# EAGLE design stereo-pwm-v2 (EAGLE 5.04)
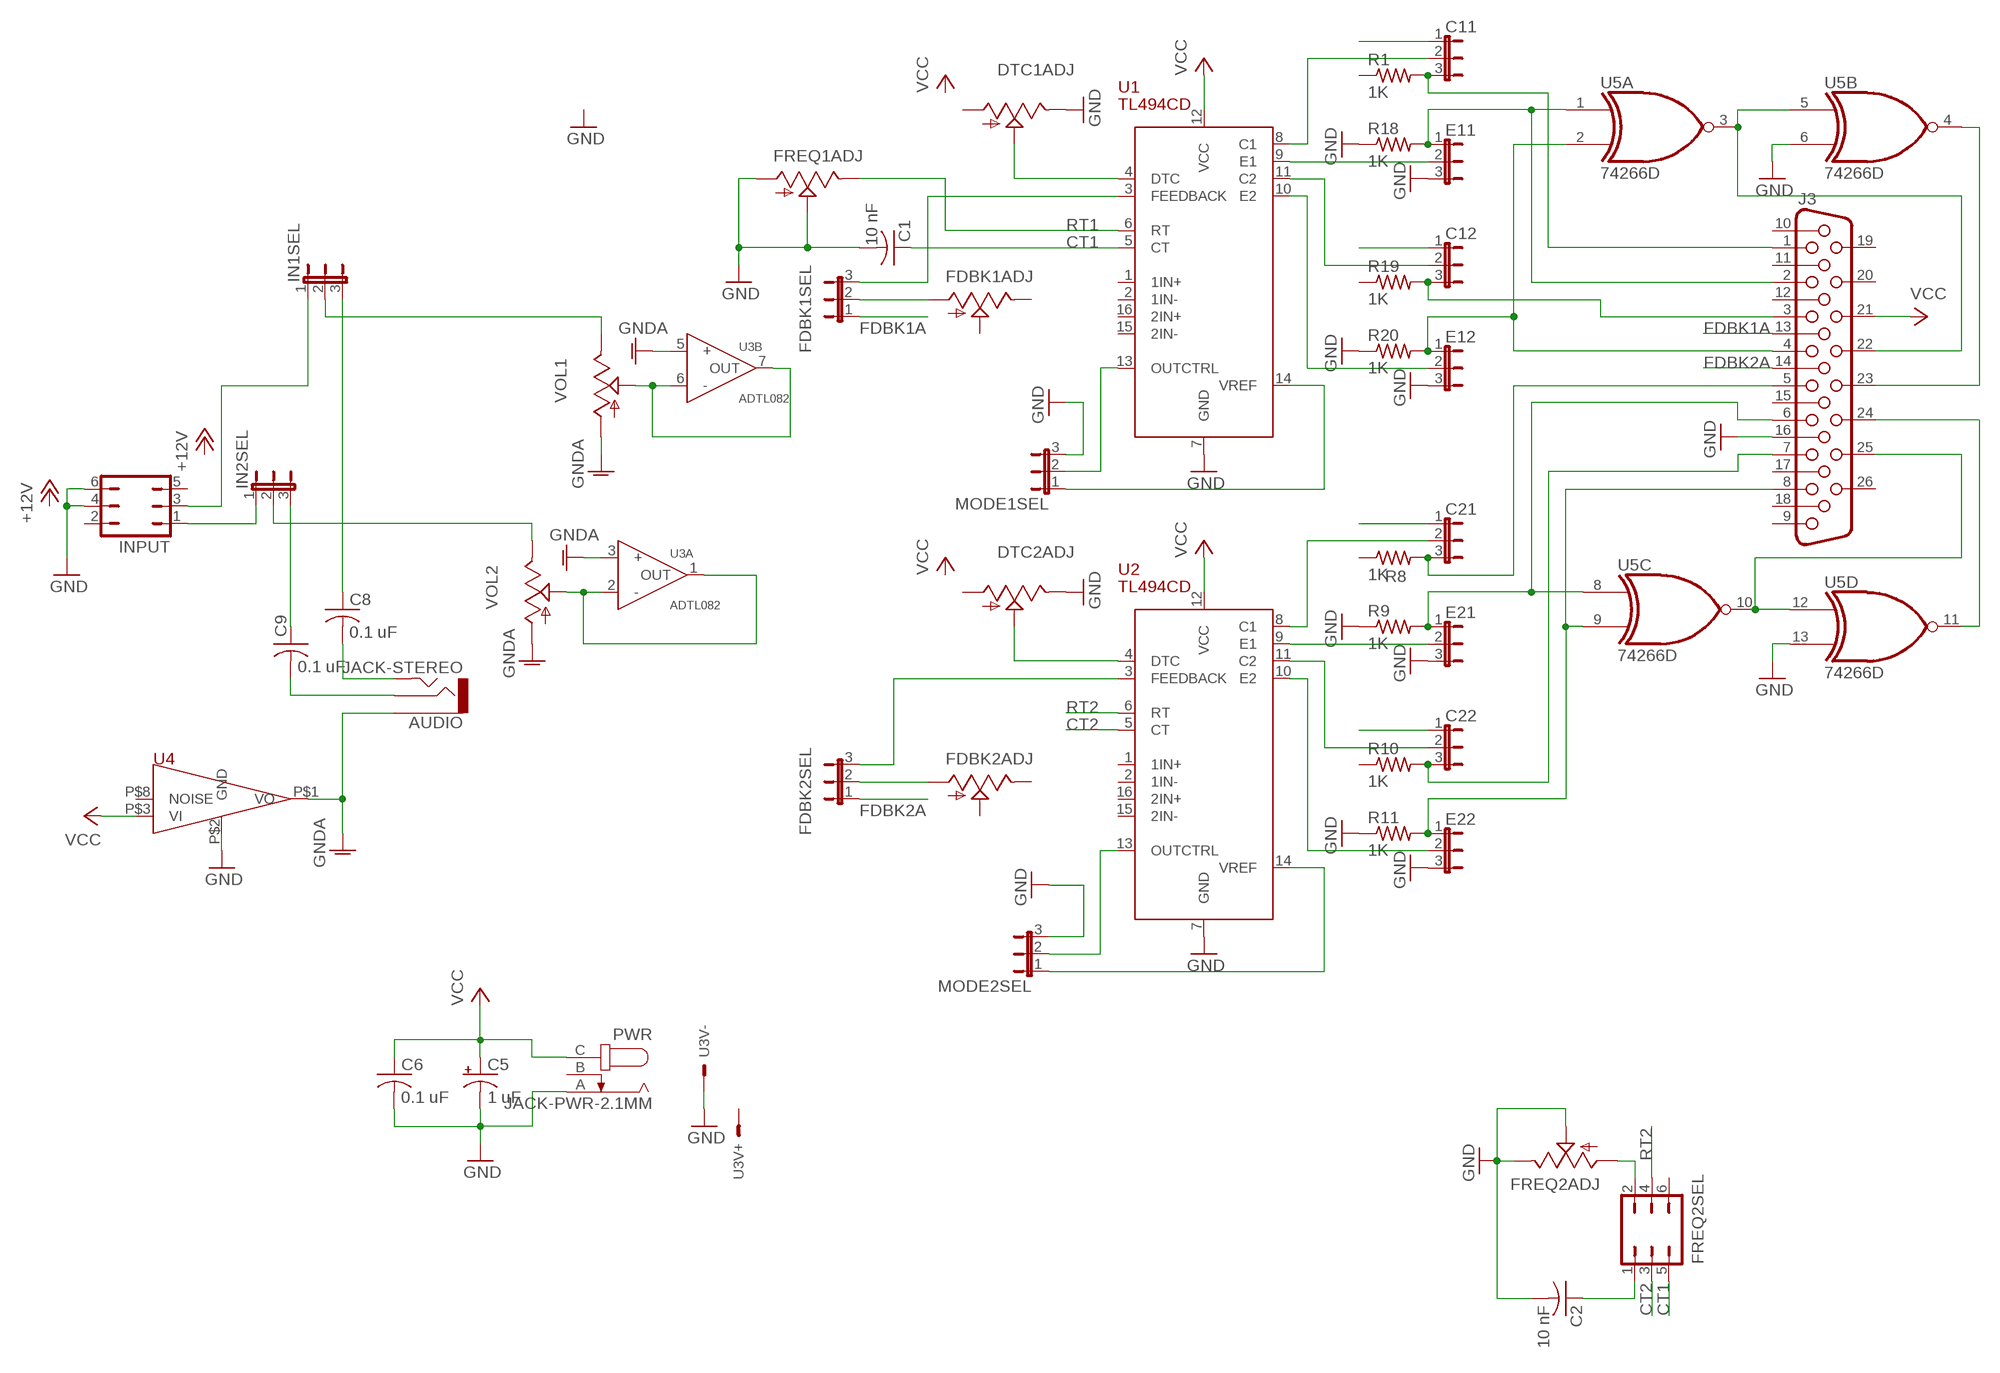
[diagram p0: schematic, sheet 1]

## Parts
AUDIO  JACK-STEREO  [AUDIO-JACK]
C1  10 nF  C-USC0603  [C0603]
C2  10 nF  C-USC0603  [C0603]
C5  1 uF  CPOL-US153CLV-0405  [153CLV-0405]
C6  0.1 uF  C-USC1206  [C1206]
C8  0.1 uF  C-USC1206  [C1206]
C9  0.1 uF  C-USC1206  [C1206]
C11  JP2E  [JP2]
C12  JP2E  [JP2]
C21  JP2E  [JP2]
C22  JP2E  [JP2]
DTC1ADJ  TRIM_US-CT6  [CT6]
DTC2ADJ  TRIM_US-CT6  [CT6]
E11  JP2E  [JP2]
E12  JP2E  [JP2]
E21  JP2E  [JP2]
E22  JP2E  [JP2]
FDBK1ADJ  TRIM_US-CT6  [CT6]
FDBK1SEL  JP2E  [JP2]
FDBK2ADJ  TRIM_US-CT6  [CT6]
FDBK2SEL  JP2E  [JP2]
FREQ1ADJ  TRIM_US-CT6  [CT6]
FREQ2ADJ  TRIM_US-CT6  [CT6]
FREQ2SEL  JP3Q  [JP3Q]
IN1SEL  JP2E  [JP2]
IN2SEL  JP2E  [JP2]
INPUT  JP3Q  [JP3Q]
J3  HF26V  [HDF26V]
MODE1SEL  JP2E  [JP2]
MODE2SEL  JP2E  [JP2]
PWR  JACK-PWR-2.1MM  [2.1MM-JACK-PLUG]
R1  1K  R-US_R0603  [R0603]
R8  1K  R-US_R0603  [R0603]
R9  1K  R-US_R0603  [R0603]
R10  1K  R-US_R0603  [R0603]
R11  1K  R-US_R0603  [R0603]
R18  1K  R-US_R0603  [R0603]
R19  1K  R-US_R0603  [R0603]
R20  1K  R-US_R0603  [R0603]
U1  TL494CD  [SO16]
U2  TL494CD  [SO16]
U3  ADTL082  [SO8]
U4  TLE2426  [SOIC-8]
U5  74266D  [SO14]
VOL1  TRIM_US-CT6  [CT6]
VOL2  TRIM_US-CT6  [CT6]

## Nets
C21: C21.3 J3.5 R8.2
CT1: C1.1 FREQ2SEL.5 U1.5(CT)
CT2: FREQ2SEL.3 U2.5(CT)
FDBK1A: FDBK1SEL.1 J3.13
FDBK2A: FDBK2SEL.1 J3.14
GND: C1.2 C2.2 C5.- C6.2 DTC1ADJ.E DTC2ADJ.E E11.3 E12.3 E21.3 E22.3 FREQ1ADJ.A FREQ1ADJ.S FREQ2ADJ.E FREQ2ADJ.S INPUT.4 INPUT.6 J3.16 MODE1SEL.3 MODE2SEL.3 PWR.A R9.1 R11.1 R18.1 R20.1 U1.7(GND) U2.7(GND) U3.4(V-:S) U4.P$2(GND) U5.6(B:I1) U5.13(D:I1)
GNDA: AUDIO.1 U3.3(A:+) U3.5(B:+) U4.P$1(VO) VOL1.A VOL2.A
N$1: MODE2SEL.2 U2.13(OUTCTRL)
N$2: FREQ2ADJ.A FREQ2SEL.2
N$3: MODE1SEL.2 U1.13(OUTCTRL)
N$4: IN2SEL.2 VOL2.E
N$5: C21.2 U2.8(C1)
N$6: E21.2 U2.9(E1)
N$7: E22.2 U2.10(E2)
N$8: AUDIO.3 C8.2
N$9: C22.2 U2.11(C2)
N$10: C2.1 FREQ2SEL.1
N$11: FDBK1SEL.3 U1.3(FEEDBACK)
N$12: AUDIO.2 C9.2
N$13: MODE1SEL.1 U1.14(VREF)
N$14: E21.1 J3.6 R9.2 U5.8(C:I0)
N$15: C22.3 J3.7 R10.2
N$16: E22.1 J3.8 R11.2 U5.9(C:I1)
N$17: DTC1ADJ.S U1.4(DTC)
N$18: IN1SEL.2 VOL1.E
N$19: C8.1 IN1SEL.3
N$20: FDBK1ADJ.A FDBK1SEL.2
N$21: DTC2ADJ.S
N$22: U3.6(B:-) U3.7(B:OUT) VOL1.S
N$23: C9.1 IN2SEL.3
N$24: C11.2 U1.8(C1)
N$25: IN2SEL.1 INPUT.1
N$26: IN1SEL.1 INPUT.3
N$27: E11.2
N$28: C22.1
N$29: C21.1
N$30: C12.1
N$31: U3.1(A:OUT) U3.2(A:-) VOL2.S
N$32: E12.2 U1.10(E2)
N$33: C12.2 U1.11(C2)
N$34: C11.1
N$36: C11.3 J3.1 R1.2
N$37: E11.1 J3.2 R18.2 U5.1(A:I0)
N$38: C12.3 J3.3 R19.2
N$39: E12.1 J3.4 R20.2 U5.2(A:I1)
N$40: J3.22 U5.3(A:O) U5.5(B:I0)
N$41: J3.24 U5.11(D:O)
N$42: J3.25 U5.10(C:O) U5.12(D:I0)
N$44: MODE2SEL.1 U2.14(VREF)
N$45: J3.23 U5.4(B:O)
N$46: FDBK2ADJ.A FDBK2SEL.2
N$47: FDBK2SEL.3 U2.3(FEEDBACK)
RT1: FREQ1ADJ.E U1.6(RT)
RT2: FREQ2SEL.4 U2.6(RT)
VCC: C5.+ C6.1 J3.21 PWR.C U1.12(VCC) U2.12(VCC) U4.P$3(VI)
Unconnected: DTC1ADJ.A DTC2ADJ.A FDBK1ADJ.E FDBK1ADJ.S FDBK2ADJ.E FDBK2ADJ.S FREQ2SEL.6 INPUT.2 INPUT.5 J3.9 J3.10 J3.11 J3.12 J3.15 J3.17 J3.18 J3.19 J3.20 J3.26 PWR.B R1.1 R8.1 R10.1 R19.1 U1.1(1IN+) U1.2(1IN-) U1.9(E1) U1.15(2IN-) U1.16(2IN+) U2.1(1IN+) U2.2(1IN-) U2.4(DTC) U2.15(2IN-) U2.16(2IN+) U3.8(V+:S) U4.P$8(NOISE)

## Power pins joined to a net without a drawn wire
GND: U5.7(P:GND)
VCC: U5.14(P:VCC)

## Library data of the parts
AUDIO = logos-faves:JACK-STEREO
C1 C2 C6 C8 C9 = resistor:C-US: CAPACITOR, American symbol
C5 = resistor:CPOL-US: POLARIZED CAPACITOR, American symbol
C11 C12 C21 C22 E11 E12 E21 E22 FDBK1SEL FDBK2SEL IN1SEL IN2SEL MODE1SEL MODE2SEL = jumper:JP2E: JUMPER
DTC1ADJ DTC2ADJ FDBK1ADJ FDBK2ADJ FREQ1ADJ FREQ2ADJ VOL1 VOL2 = pot:TRIM_US-: POTENTIOMETER
FREQ2SEL INPUT = jumper:JP3Q: JUMPER
J3 = con-subd:HF26: SUB-D
PWR = logos-faves:JACK-PWR-2.1MM
R1 R8-R11 R18-R20 = resistor:R-US_: RESISTOR, American symbol
U1 U2 = logos-faves:TL494CD
U3 = logos-faves:ADTL082: dual op-amp
U4 = logos-faves:TLE2426
U5 = 74xx-us:74*266: Quadruple EXCLUSIVE-NOR (XNOR), open-collector

## Board
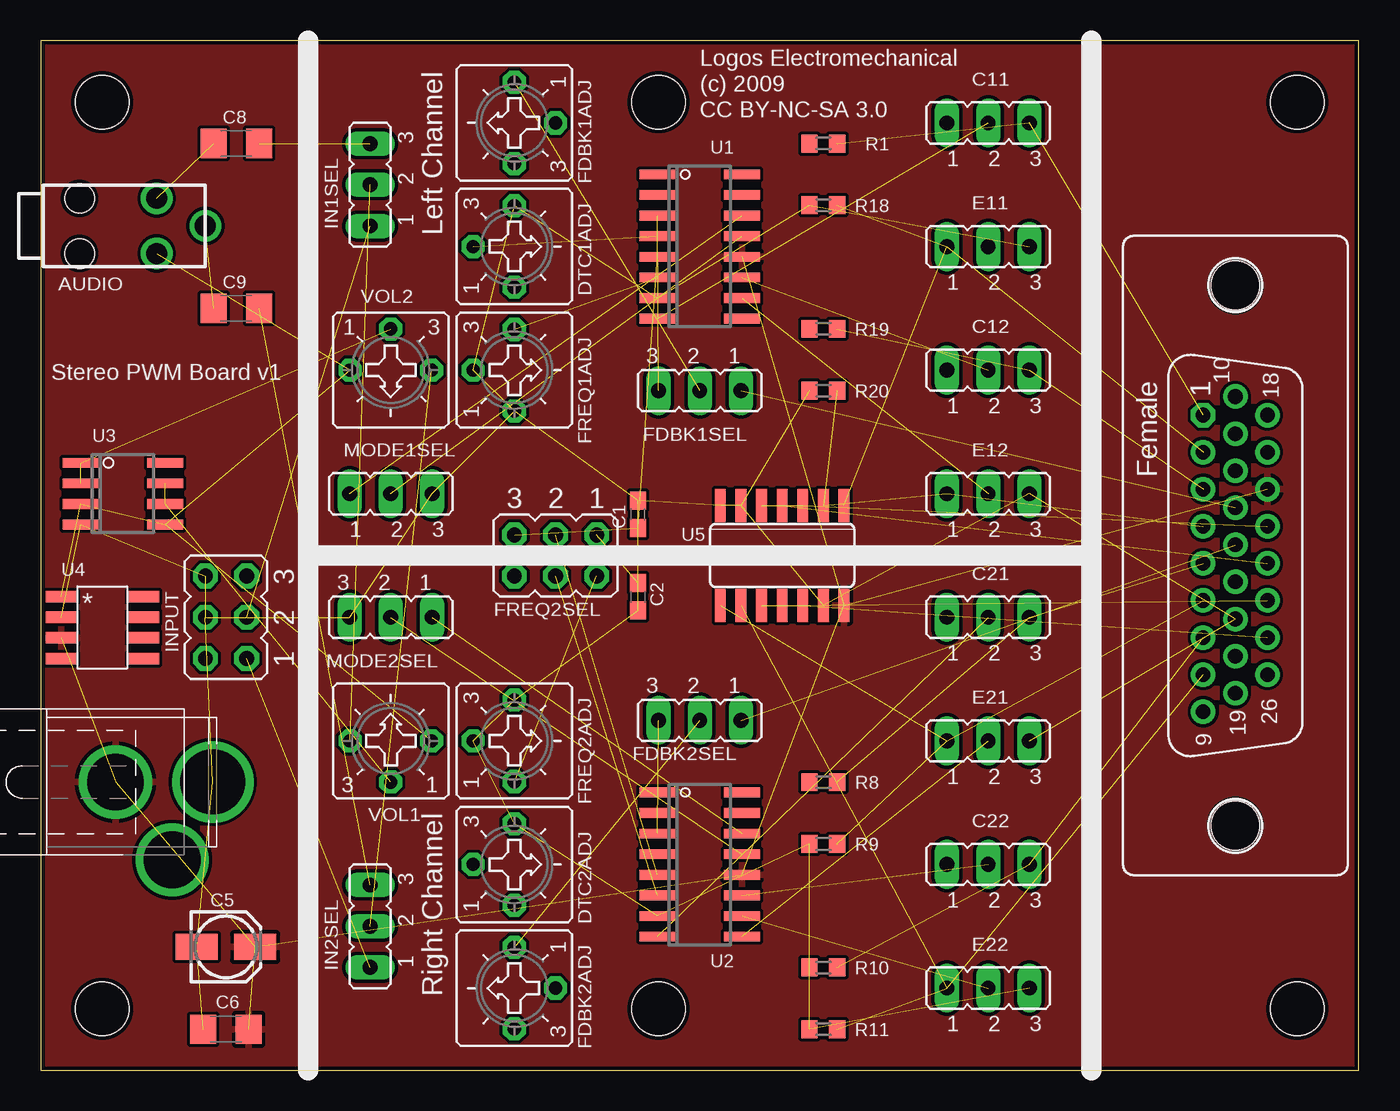
[diagram p1: board, top side]
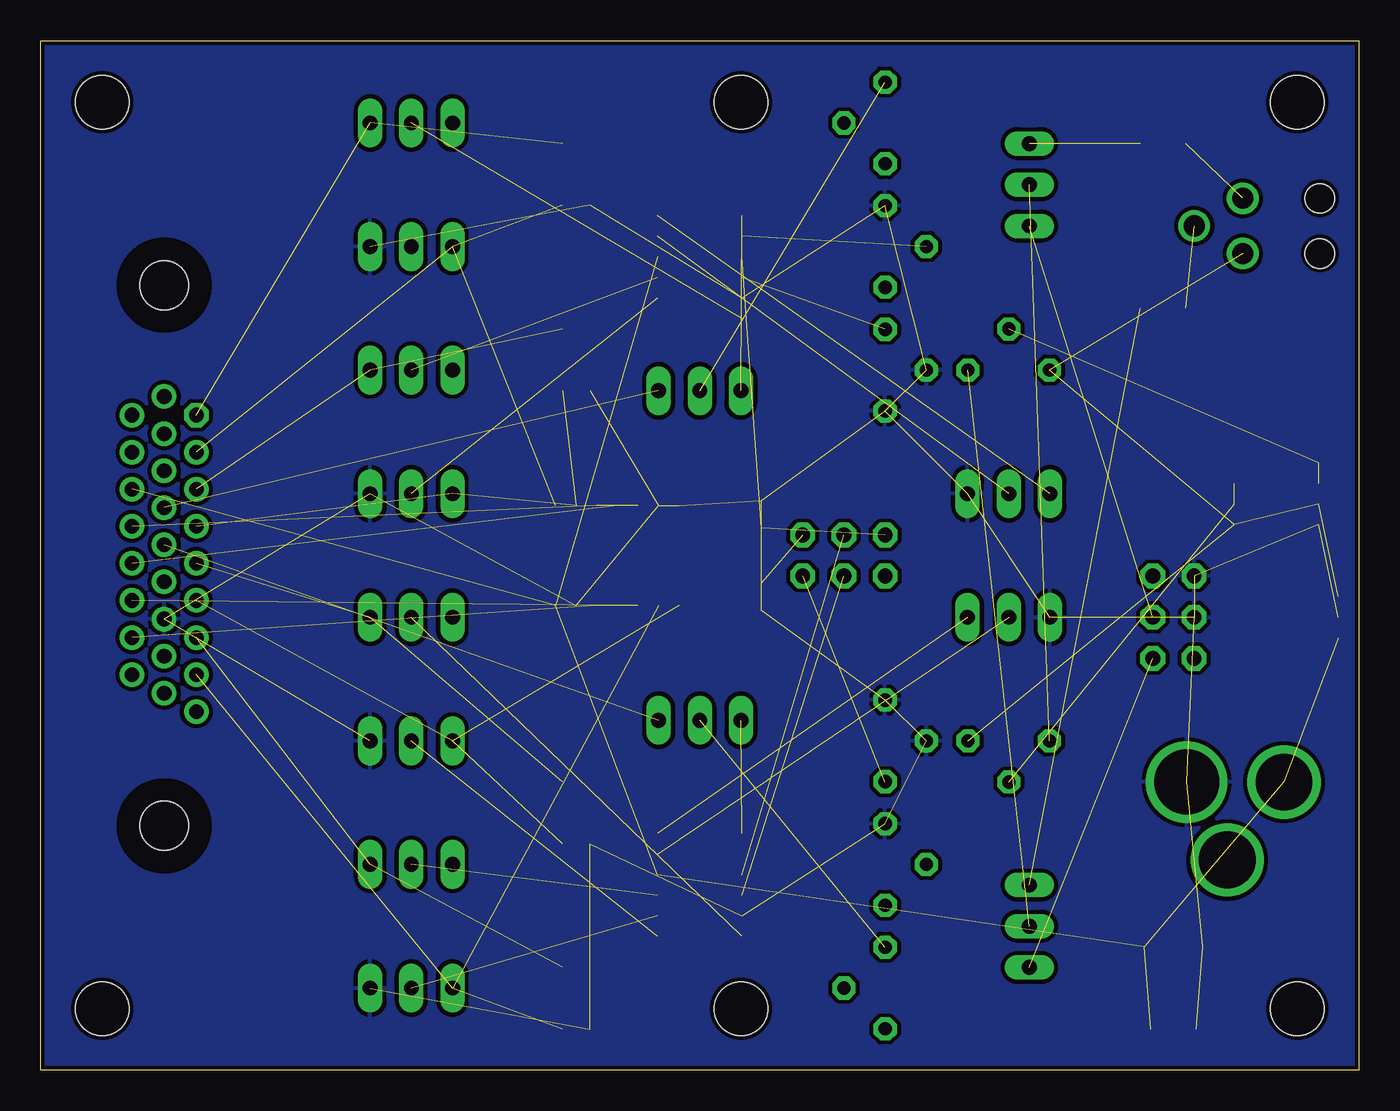
[diagram p2: board, bottom side, seen from below]

Size 81.28 x 63.5 mm. Coordinates in mm from the lower left corner, seen from the top.
Outline: 0,0 81.28,0 81.28,63.5 0,63.5 0,0
Copper layers (1*16): Top 0.035mm / dielectric 1.5mm / Bottom 0.035mm
Design rules "SparkFun": minimum track width 8mil, minimum drill 20mil, track to track 8mil, track to pad 8mil, pad to pad 8mil, via to via 8mil, smd to smd 8mil, copper to edge 10mil, drill to drill 8mil, minimum pad ring 12mil, minimum via ring 10mil, stop-mask expansion 4mil, vias tented up to drill 25mil, thermal gap 10mil

### Footprints (pad centres in the part's own frame; a part is rotated, then mirrored left to right if it is on the bottom)
AUDIO-JACK = drill 1.3 round: 1 3,1.7; 2 0,0; 3 3,-1.7 | hole 1.8: 7.75,1.7; 7.75,-1.7
C0603 = smd 1.1 x 1: 1 -0.85,0; 2 0.85,0
153CLV-0405 = smd 2.6 x 1.6: + 1.8,0; - -1.8,0
C1206 = smd 1.6 x 1.8: 1 -1.4,0; 2 1.4,0
JP2 = drill 0.914 long: 1 -2.54,0; 2 0,0; 3 2.54,0
CT6 = drill 0.813 octagon: A 2.515,0; E -2.515,0; S 0,-2.54
JP3Q = drill 0.914 octagon: 1 -2.54,-1.27; 2 -2.54,1.27; 3 0,-1.27; 4 0,1.27; 5 2.54,-1.27; 6 2.54,1.27
HDF26V = drill 0.9 octagon: 1 8.658,1.98 | drill 0.9 round: 2 6.372,1.98; 3 4.086,1.98; 4 1.8,1.98; 5 -0.486,1.98; 6 -2.772,1.98; 7 -5.058,1.98; 8 -7.344,1.98; 9 -9.63,1.98; 10 9.801,0; 11 7.515,0; 12 5.229,0; 13 2.943,0; 14 0.657,0; 15 -1.629,0; 16 -3.915,0; 17 -6.201,0; 18 -8.487,0; 19 8.658,-1.98; 20 6.372,-1.98; 21 4.086,-1.98; 22 1.8,-1.98; 23 -0.486,-1.98; 24 -2.772,-1.98; 25 -5.058,-1.98; 26 -7.344,-1.98 | hole 3: -16.65,0; 16.65,0
2.1MM-JACK-PLUG = drill 4 round: A 3,0 | drill 3.5 round: B 0.5,-4.8; C -3,0
R0603 = smd 1 x 1.1: 1 -0.85,0; 2 0.85,0
SO16 = smd 0.6 x 2.2: 1 -4.445,-2.6; 2 -3.175,-2.6; 3 -1.905,-2.6; 4 -0.635,-2.6; 5 0.635,-2.6; 6 1.905,-2.6; 7 3.175,-2.6; 8 4.445,-2.6; 9 4.445,2.6; 10 3.175,2.6; 11 1.905,2.6; 12 0.635,2.6; 13 -0.635,2.6; 14 -1.905,2.6; 15 -3.175,2.6; 16 -4.445,2.6
SO8 = smd 0.6 x 2.2: 1 -1.905,-2.6; 2 -0.635,-2.6; 3 0.635,-2.6; 4 1.905,-2.6; 5 1.905,2.6; 6 0.635,2.6; 7 -0.635,2.6; 8 -1.905,2.6
SOIC-8 = smd 1.905 x 0.711: P$1 -2.54,0; P$2 -2.54,-1.27; P$3 -2.54,-2.54; P$4 -2.54,-3.81; P$5 2.54,0; P$6 2.54,-1.27; P$7 2.54,-2.54; P$8 2.54,-3.81
SO14 = smd 0.66 x 2.032: 1 -3.81,-3.073; 2 -2.54,-3.073; 3 -1.27,-3.073; 4 0,-3.073; 5 1.27,-3.073; 6 2.54,-3.073; 7 3.81,-3.073; 8 3.81,3.073; 9 2.54,3.073; 10 1.27,3.073; 11 0,3.073; 12 -1.27,3.073; 13 -2.54,3.073; 14 -3.81,3.073
STAND-OFF = hole 3.302: 0,0

### Placement (x,y rotation side)
AUDIO  10.16,52.07 180 top
C1  36.83,34.29 90 top
C2  36.83,29.21 270 top
C5  11.43,7.62 0 top
C6  11.43,2.54 180 top
C8  12.06,57.15 180 top
C9  12.06,46.99 180 top
C11  58.42,58.42 0 top
C12  58.42,43.18 0 top
C21  58.42,27.94 0 top
C22  58.42,12.7 0 top
DTC1ADJ  29.21,50.8 270 top
DTC2ADJ  29.21,12.7 270 top
E11  58.42,50.8 0 top
E12  58.42,35.56 0 top
E21  58.42,20.32 0 top
E22  58.42,5.08 0 top
FDBK1ADJ  29.21,58.42 90 top
FDBK1SEL  40.64,41.91 180 top
FDBK2ADJ  29.21,5.08 90 top
FDBK2SEL  40.64,21.59 180 top
FREQ1ADJ  29.21,43.18 270 top
FREQ2ADJ  29.21,20.32 270 top
FREQ2SEL  31.75,31.75 180 top
IN1SEL  20.32,54.61 90 top
IN2SEL  20.32,8.89 90 top
INPUT  11.43,27.94 90 top
J3  73.66,31.75 90 top
MODE1SEL  21.59,35.56 0 top
MODE2SEL  21.59,27.94 180 top
PWR  7.62,17.78 0 top
R1  48.26,57.15 0 top
R8  48.26,17.78 0 top
R9  48.26,13.97 0 top
R10  48.26,6.35 0 top
R11  48.26,2.54 0 top
R18  48.26,53.34 0 top
R19  48.26,45.72 0 top
R20  48.26,41.91 0 top
U1  40.64,50.8 270 top
U2  40.64,12.7 270 top
U3  5.08,35.56 270 top
U4  3.81,29.21 0 top
U5  45.72,31.75 180 top
U$1  [STAND-OFF]  3.81,59.69 0 top
U$2  [STAND-OFF]  3.81,3.81 0 top
U$3  [STAND-OFF]  77.47,3.81 0 top
U$4  [STAND-OFF]  77.47,59.69 0 top
U$5  [STAND-OFF]  38.1,59.69 0 top
U$6  [STAND-OFF]  38.1,3.81 0 top
VOL1  21.59,20.32 0 top
VOL2  21.59,43.18 180 top

### Tracks (layer width: path | path; a pad name or v marks a point on that pad's centre or on a via)
C21  (2 unrouted)
CT1  (2 unrouted)
CT2  (1 unrouted)
FDBK1A  (1 unrouted)
FDBK2A  (1 unrouted)
GND  (30 unrouted)
  pour Bottom (isolate 0.254): 0,63.5 81.28,63.5 81.28,0 0,0
GNDA  (5 unrouted)
N$1  (1 unrouted)
N$2  (1 unrouted)
N$3  (1 unrouted)
N$4  (1 unrouted)
N$5  (1 unrouted)
N$6  (1 unrouted)
N$7  (1 unrouted)
N$8  (1 unrouted)
N$9  (1 unrouted)
N$10  (1 unrouted)
N$11  (1 unrouted)
N$12  (1 unrouted)
N$13  (1 unrouted)
N$14  (3 unrouted)
N$15  (2 unrouted)
N$16  (3 unrouted)
N$17  (1 unrouted)
N$18  (1 unrouted)
N$19  (1 unrouted)
N$20  (1 unrouted)
N$22  (2 unrouted)
N$23  (1 unrouted)
N$24  (1 unrouted)
N$25  (1 unrouted)
N$26  (1 unrouted)
N$31  (2 unrouted)
N$32  (1 unrouted)
N$33  (1 unrouted)
N$36  (2 unrouted)
N$37  (3 unrouted)
N$38  (2 unrouted)
N$39  (3 unrouted)
N$40  (2 unrouted)
N$41  (1 unrouted)
N$42  (2 unrouted)
N$44  (1 unrouted)
N$45  (1 unrouted)
N$46  (1 unrouted)
N$47  (1 unrouted)
RT1  (1 unrouted)
RT2  (1 unrouted)
VCC  (7 unrouted)
  pour Top: 0,63.5 81.28,63.5 81.28,0 0,0

### Text on the board
tPlace: Logos Electromechanical | (c) 2009 | CC BY-NC-SA 3.0 | Stereo PWM Board v1
tNames: Left Channel | Right Channel